# Altium schematic sheet 14_SD.SchDoc
size A4
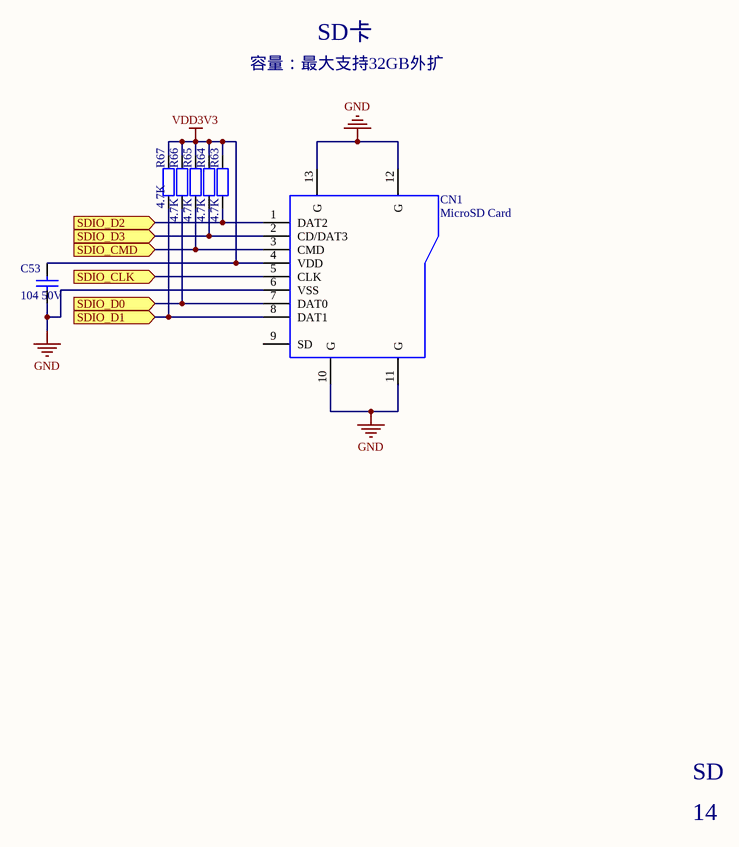
[diagram p0: 14_SD.SchDoc]

## Parts
C53  104 50V  [SMD-0603C]
CN1  MicroSD Card  [SD_Card_TF]
R63  4.7K  [SMD-0603]
R64  4.7K  [SMD-0603]
R65  4.7K  [SMD-0603]
R66  4.7K  [SMD-0603]
R67  4.7K  [SMD-0603]

## Ports
SDIO_CLK (in), SDIO_CMD (in), SDIO_D0 (in), SDIO_D1 (in), SDIO_D2 (in), SDIO_D3 (in)

## Nets
GND: C53.2 CN1.6(VSS) CN1.10(G) CN1.11(G) CN1.12(G) CN1.13(G)
VDD3V3: C53.1 CN1.4(VDD) R63.1 R64.1 R65.1 R66.1 R67.1
SDIO_CLK: CN1.5(CLK) ; port SDIO_CLK
SDIO_CMD: CN1.3(CMD) R65.2 ; port SDIO_CMD
SDIO_D0: CN1.7(DAT0) R66.2 ; port SDIO_D0
SDIO_D1: CN1.8(DAT1) R67.2 ; port SDIO_D1
SDIO_D2: CN1.1(DAT2) R63.2 ; port SDIO_D2
SDIO_D3: CN1.2(CD/DAT3) R64.2 ; port SDIO_D3

Not connected (* = marked no-connect by the designer): CN1 9(SD)

## Notes on the sheet
- 容量：最大支持32GB外扩
- SD卡
- SD
- 14

## Library data of the parts
C53 = CAP4: 贴片电容 20%
CN1 = SD Card
R63-R67 = RES2: 贴片电阻 5%